# Altium schematic sheet SCH_P1.5_150321.SchDoc
size 304 x 241 mm; PageSetup: Record=PageOptions|CenterHorizontal=True|CenterVertical=True|PrintScale=0.88|XCorrection=1.00|YCorrection=1.00|PrintKind=2|BorderSize=5000000|LeftOffset=0|BottomOffset=0|Orientation=2|PaperLength=1000|PaperWidth=1000|Scale=100|PaperSource=7|PrintQuality=-3|MediaType=1|DitherType=10|PrintScaleMode=1|PaperKind=Letter|PaperIndex=1
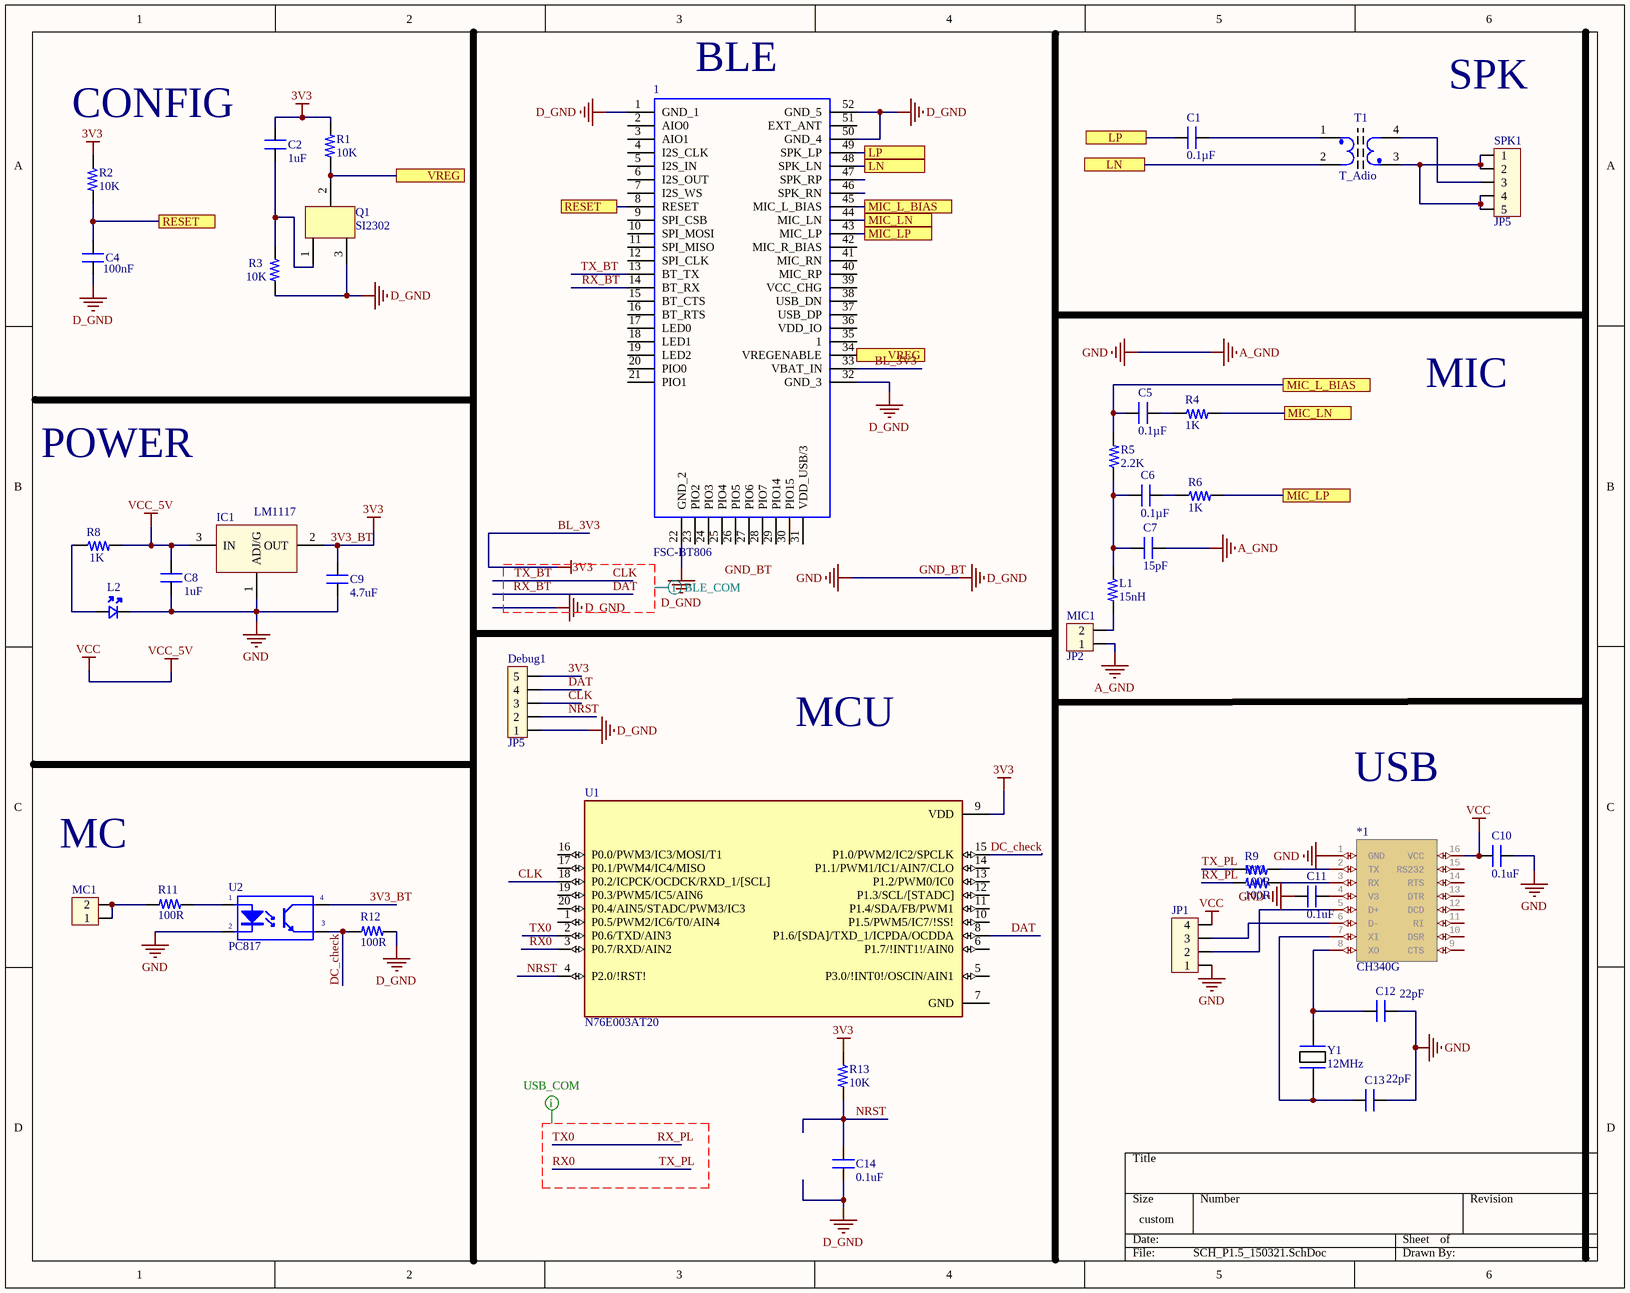
[diagram p0: SCH_P1.5_150321.SchDoc]

## Parts
1  FSC-BT806  [FSCBT806]
*1  CH340G  [CH340G]
C1  0.1µF  [CAP_0805]
C2  1uF  [CAP_0805]
C4  100nF  [CAP_0805]
C5  0.1µF  [CAP_0805]
C6  0.1µF  [CAP_0805]
C7  15pF  [CAP_0805]
C8  1uF  [CAP_0805]
C9  4.7uF  [CAP_0805]
C10  0.1uF  [CAP_0805]
C11  0.1uF  [CAP_0805]
C12  22pF  [CAP_0805]
C13  22pF  [CAP_0805]
C14  0.1uF  [CAP_0805]
Debug1  JP5  [JP5]
IC1  LM1117  [SOT223-4N]
JP1  (no value)  [CON4]
L1  15nH  [RES_0805]
L2  (no value)  [LED_0805]
MC1  (no value)  [CON2]
MIC1  JP2  [CON2]
Q1  SI2302  [SOT23A]
R1  10K  [RES_0805]
R2  10K  [RES_0805]
R3  10K  [RES_0805]
R4  1K  [RES_0805]
R5  2.2K  [RES_0805]
R6  1K  [RES_0805]
R8  1K  [RES_0805]
R9  100R  [RES_0805]
R10  100R  [RES_0805]
R11  100R  [RES_0805]
R12  100R  [RES_0805]
R13  10K  [RES_0805]
SPK1  JP5  [CON5]
T1  T_Adio  [T_Adito]
U1  N76E003AT20  [SOP65P640X120-20N]
U2  PC817  [DIP4/W0.3]
Y1  12MHz  [XTAL_314_240X47_SMD]

## Ports
LN, LP, MIC_L_BIAS, MIC_LN, MIC_LP, RESET, VREG

## Nets
3V3: 1.33(VBAT_IN) C2.2 C9.2 Debug1.5 IC1.2(OUT) R1.2 R2.2 R13.2 U1.9(VDD) U2.4(C)  [also labelled 3V3_BT, BL_3V3]
GND_BT: 1.1(GND_1) 1.22(GND_2) 1.32(GND_3) 1.50(GND_4) 1.52(GND_5) *1.1(GND) C4.1 C7.2 C8.1 C9.1 C10.1 C11.2 C12.2 C13.1 C14.1 Debug1.1 IC1.1(ADJ/G) JP1.1 L2.K MIC1.1 Q1.3 R3.1 R12.2 U2.2(K)  [also labelled A_GND, D_GND, GND]
VCC: *1.16(VCC) C8.2 C10.2 IC1.3(IN) JP1.4 R8.1  [also labelled VCC_5V]
CLK: 1.13(BT_TX) Debug1.3 U1.18(P0.2/ICPCK/OCDCK/RXD_1/[SCL])  [also labelled TX_BT]
DAT: 1.14(BT_RX) Debug1.4 U1.8(P1.6/[SDA]/TXD_1/ICPDA/OCDDA)  [also labelled RX_BT]
DC_check: R12.1 U1.15(P1.0/PWM2/IC2/SPCLK) U2.3(E)
LN: 1.48(SPK_LN) T1.2 ; port LN
LP: 1.49(SPK_LP) C1.1 ; port LP
MIC_L_BIAS: 1.45(MIC_L_BIAS) C5.1 R5.1 ; port MIC_L_BIAS
MIC_LN: 1.44(MIC_LN) R4.1 ; port MIC_LN
MIC_LP: 1.43(MIC_LP) R6.1 ; port MIC_LP
NRST: C14.2 Debug1.2 R13.1 U1.4(P2.0/!RST!)
RESET: 1.8(RESET) C4.2 R2.1 ; port RESET
RX0: R9.2 U1.3(P0.7/RXD/AIN2)  [also labelled TX_PL]
RX_PL: R10.2 U1.2(P0.6/TXD/AIN3)  [also labelled TX0]
VREG: 1.34(VREGENABLE) Q1.2 R1.1 ; port VREG
Net*1_2: *1.2(TX) R9.1
Net*1_3: *1.3(RX) R10.1
Net*1_4: *1.4(V3) C11.1
Net*1_5: *1.5(D+) JP1.2
Net*1_6: *1.6(D-) JP1.3
Net*1_7: *1.7(XI) C13.2 Y1.2
Net*1_8: *1.8(XO) C12.1 Y1.1
NetC1_2: C1.2 T1.1
NetC2_1: C2.1 Q1.1 R3.2
NetC5_2: C5.2 R4.2
NetC6_1: C6.1 C7.1 L1.2 R5.2
NetC6_2: C6.2 R6.2
NetL1_1: L1.1 MIC1.2
NetL2_A: L2.A R8.2
NetMC1_1: MC1.1 MC1.2 R11.1
NetR11_2: R11.2 U2.1(A)
NetSPK1_1: SPK1.1 SPK1.2 SPK1.4 SPK1.5 T1.3
NetSPK1_3: SPK1.3 T1.4

Not connected (* = marked no-connect by the designer): 1 2(AIO0) 3(AIO1) 4(I2S_CLK) 5(I2S_IN) 6(I2S_OUT) 7(I2S_WS) 9(SPI_CSB) 10(SPI_MOSI) 11(SPI_MISO) 12(SPI_CLK) 15(BT_CTS) 16(BT_RTS) 17(LED0) 18(LED1) 19(LED2) 20(PIO0) 21(PIO1) 23(PIO2) 24(PIO3) 25(PIO4) 26(PIO5) 27(PIO6) 28(PIO7) 29(PIO14) 30(PIO15) 31(VDD_USB/3) 35(1) 36(VDD_IO) 37(USB_DP) 38(USB_DN) 39(VCC_CHG) 40(MIC_RP) 41(MIC_RN) 42(MIC_R_BIAS) 46(SPK_RN) 47(SPK_RP) 51(EXT_ANT); *1 9(CTS) 10(DSR) 11(RI) 12(DCD) 13(DTR) 14(RTS) 15(RS232); U1 1(P0.5/PWM2/IC6/T0/AIN4) 5(P3.0/!INT0!/OSCIN/AIN1) 6(P1.7/!INT1!/AIN0) 7(GND) 10(P1.5/PWM5/IC7/!SS!) 11(P1.4/SDA/FB/PWM1) 12(P1.3/SCL/[STADC]) 13(P1.2/PWM0/IC0) 14(P1.1/PWM1/IC1/AIN7/CLO) 16(P0.0/PWM3/IC3/MOSI/T1) 17(P0.1/PWM4/IC4/MISO) 19(P0.3/PWM5/IC5/AIN6) 20(P0.4/AIN5/STADC/PWM3/IC3)

## Layout directives
net class Undefined: 3V3, CLK, D_GND, DAT, RX0, RX_BT, RX_PL, TX0, TX_BT, TX_PL

## Notes on the sheet
- (near 1) BLE
- SPK
- (near R2) CONFIG
- MIC
- POWER
- MCU
- USB
- MC
- Labels drawn without touching a wire or pin: GND_BT

## Library data of the parts
C1 C5-C7 C10 C11 C14 = CAP_0.1uF-50V-5%-0805: 0.1µF ±5% 50V Ceramic Capacitor X7R 0805 (2012 Metric); Manufacturer: KEMET; Manufacturing Part Number: C0805C104J5RACTU; Case/Package: 0805 (2012 Metric); Supplier-1: Digikey; Supplier Part Number-1: 399-1171-1-ND
C2 C8 = CAP_1uF-50V-5%-0805: 1µF ±5% 50V Ceramic Capacitor X7R 0805 (2012 Metric); Manufacturer: Yageo; Manufacturing Part Number: CC0805JKX7R9BB105; Case/Package: 0805 (2012 Metric); Supplier-1: Digikey; Supplier Part Number-1: 311-3498-1-ND
C4 = CAP_1uF-50V-5%-0805: 100µF ±5% 50V Ceramic Capacitor X7R 0805 (2012 Metric); Manufacturer: Yageo; Manufacturing Part Number: CC0805JKX7R9BB105; Case/Package: 0805 (2012 Metric); Supplier-1: Digikey; Supplier Part Number-1: 311-3498-1-ND
C9 = CAP_1uF-50V-5%-0805: 4.7µF ±5% 50V Ceramic Capacitor X7R 0805 (2012 Metric); Manufacturer: Yageo; Manufacturing Part Number: CC0805JKX7R9BB105; Case/Package: 0805 (2012 Metric); Supplier-1: Digikey; Supplier Part Number-1: 311-3498-1-ND
C12 C13 = CAP_22pF-50V-5%-0805: 22pF ±5% 50V Ceramic Capacitor C0G, NP0 0805 (2012 Metric); Manufacturer: KEMET; Manufacturer Part Number: C0805C220J5GACTU; Case/Package: 0805; Supplier-1: Digikey; Supplier Part Number-1: 399-1113-1-ND
IC1 = LM1117: Available in 1.8V, 2.5V, 2.85V, 3.3V, 5V, and  Adjustable Versions; Value: LM317
JP1 = Con4: Connector 4; Value: Connector 4
L1 = RES_1K-0.125W-1%-0805: Conductor 15nH; Manufacturer: 垈㎵á; Manufacturer Part Number: RC0805FR-071KL; Case/Package: 0805; Supplier-1: Digikey; Supplier Part Number-1: 311-1.00KCRCT-ND
L2 = LED-RED_10mA-0805: Red 621nm LED Indication - Discrete 2V 0805 (2012 Metric); Manufacturer: Lite-On Inc.; Manufacturer Part Number: LTST-C170EKT; Case/ Package: 0805; Supplier-1: Digikey; Supplier Part Number-1: 160-1178-1-ND
MC1 MIC1 = Con2: Connector 2; Value: Connector 2
Q1 = DV3
R1-R4 R6 = RES_10K-0.125W-1%-0805_1: 10 kOhms ±1% 0.125W, 1/8W Chip Resistor 0805 (2012 Metric) Moisture Resistant Thick Film; Manufacturer: Yageo; Manufacturing Part Number: RC0805FR-0710KL; Case/Package: 0805; Supplier-1: Digikey; Supplier Part Number-1: 311-10.0KCRCT-ND
R5 = RES_10K-0.125W-1%-0805_1: 2.2kOhms ±1% 0.125W, 1/8W Chip Resistor 0805 (2012 Metric) Moisture Resistant Thick Film; Manufacturer: Yageo; Manufacturing Part Number: RC0805FR-0710KL; Case/Package: 0805; Supplier-1: Digikey; Supplier Part Number-1: 311-10.0KCRCT-ND
R8 = RES_10K-0.125W-1%-0805_1: 1 kOhms ±1% 0.125W, 1/8W Chip Resistor 0805 (2012 Metric) Moisture Resistant Thick Film; Manufacturer: Yageo; Manufacturing Part Number: RC0805FR-0710KL; Case/Package: 0805; Supplier-1: Digikey; Supplier Part Number-1: 311-10.0KCRCT-ND
R9 R10 = RES_0ohm-0.125W-1%-0805_1: 1000Ohms ±1% 0.125W, 1/8W Chip Resistor 0805 (2012 Metric) Moisture Resistant Thick Film; Manufacturer: 垈㎵á; Manufacturer Part Number: RC0805FR-071KL; Case/Package: 0805; Supplier-1: Digikey; Supplier Part Number-1: 311-1.00KCRCT-ND
R11 R12 = RES_1K-0.125W-1%-0805: 1 kOhms ±1% 0.125W, 1/8W Chip Resistor 0805 (2012 Metric) Moisture Resistant Thick Film; Manufacturer: 垈㎵á; Manufacturer Part Number: RC0805FR-071KL; Case/Package: 0805; Supplier-1: Digikey; Supplier Part Number-1: 311-1.00KCRCT-ND
R13 = RES_10MOHM-0.125W-1%-0805: 10K ±1% 0.125W, 1/8W Chip Resistor 0805 (2012 Metric) Automotive AEC-Q200, High Voltage Thick Film; Manufacturer: Rohm Semiconductor; Manufacturing Part Number: KTR10EZPF1005; Case/Package: 0805 (2012 Metric); Supplier-1: Digikey; Supplier Part Number-1: RHM10.0MAHCT-ND
SPK1 = Con5: Connector 5; Value: Connector 5
T1 = T_Adio: Transformer Audio; Designed by: VanDungEvn; Value: BAX
U1 = N76E003AT20: 8051 N76 Microcontroller IC 8-Bit 16MHz 18KB _18K x 8_ FLASH 20-TSSOP; MF: Nuvoton Technology; Availability: Unavailable; MP: N76E003AT20; Package: TSSOP-20 Nuvoton Technology; SnapEDA_Link: https://www.snapeda.com/parts/N76E003AT20/Nuvoton%20Technology%20Corporation%20of%20America/view-part/652314/?ref=snap; Value: *; Price: None
U2 = PC817: Single Opto; Value: PC817
Y1 = XTAL_8MHZ-LFXTAL030234: Crystals 8MHz 22pF -20C 70C; Manufacturer: IQD Frequency Products; Manufacturing Part Number: LFXTAL030234Reel; Case/Package: SMD; Supplier-1: Mouser; Supplier Part Number-1: 449-LFXTAL030234REEL